# Altium schematic sheet SH8 - USB.SchDoc: Power Distribution Board Rev2 - USB
size Letter; DrawnBy: Cindy Li; Organization: Altium Limited; Address1: L3, 12a Rodborough Rd; Address2: Frenchs Forest; Address3: NSW; Address4: Australia 2086
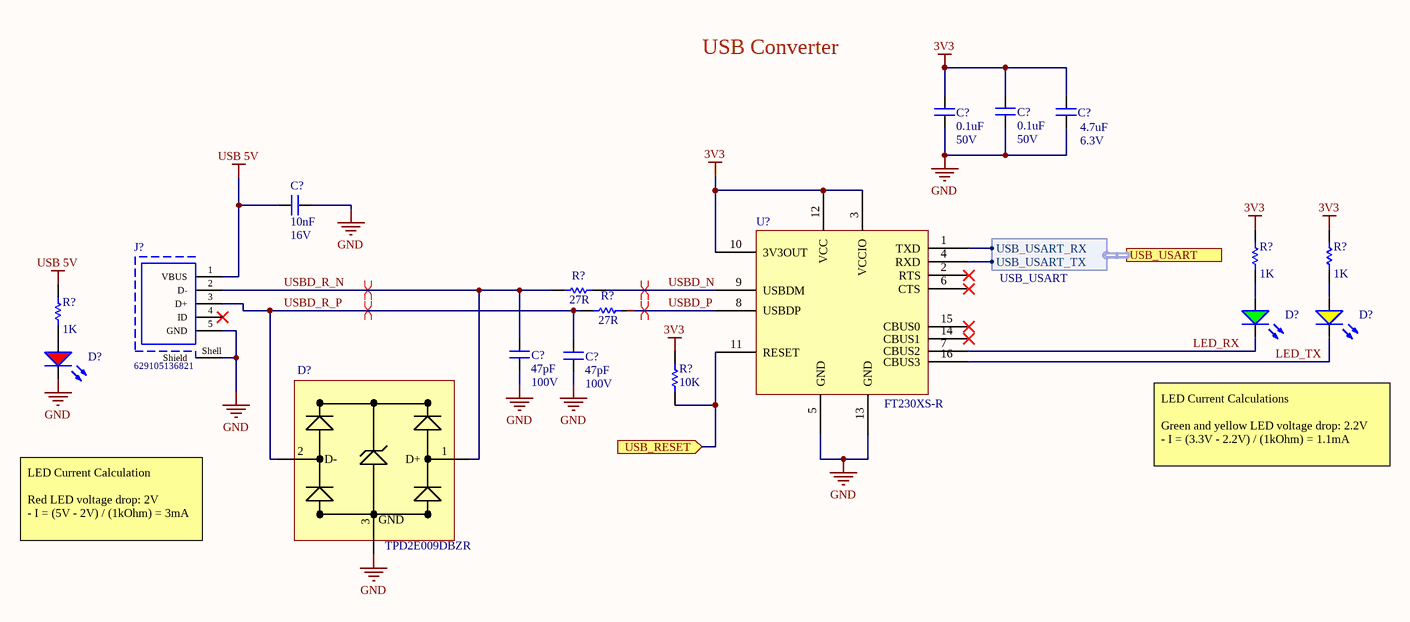
[diagram p0: SH8 - USB.SchDoc]

## Parts
(Parts that share a designator on the sheet are numbered #1, #2 ... from top to bottom, then left to right.)
C?#1  value 0.1uF  Voltage Rating: 50V  [CAPC2012X140N]  (hidden comment: CAP_0.1uF_50V_0805)
C?#2  value 0.1uF  Voltage Rating: 50V  [CAPC2012X140N]  (hidden comment: CAP_0.1uF_50V_0805)
C?#3  value 4.7uF  Voltage Rating: 6.3V  [CAPC0603(1608)55_N]  (hidden comment: CAP_4.7uF_0603)
C?#4  value 10nF  Voltage Rating: 16V  [CAPC0603(1608)55_N]  (hidden comment: CAP_10nF_0603)
C?#5  value 47pF  Voltage Rating: 100V  [CAPC1608X87N]  (hidden comment: CAP_47pF_100V_0603)
C?#6  value 47pF  Voltage Rating: 100V  [CAPC1608X87N]  (hidden comment: CAP_47pF_100V_0603)
D?#1  DIO_LED_G  [LED_0805_LINE]  (value not drawn)
D?#2  DIO_LED_Y  [LED_0805_LINE]  (value not drawn)
D?#3  DIO_LED_R  [LED_0805_LINE]  (value not drawn)
D?#4  Manufacturer Part Number: TPD2E009DBZR  [SOT23-3]  (hidden comment: TVS_DIODE_USB_5.5V)
J?  629105136821  [629105136821]
R?#1  value 1K  [RESC0603(1608)_N]  (hidden comment: RES_1K_0603)
R?#2  value 1K  [RESC0603(1608)_N]  (hidden comment: RES_1K_0603)
R?#3  Resistance: 27R  [RESC0603(1608)_N]  (hidden comment: RES_27R_0603)
R?#4  value 1K  [RESC0603(1608)_N]  (hidden comment: RES_1K_0603)
R?#5  Resistance: 27R  [RESC0603(1608)_N]  (hidden comment: RES_27R_0603)
R?#6  value 10K  [RESC0603(1608)_N]  (hidden comment: RES_10K_0603)
U?  Manufacturer Part Number 1: FT230XS-R  [SSOP16-0.635-5X4MM]  (hidden comment: IC_USB_TRANSCEIVER)

## Ports
USB_RESET (in), USB_USART (harness USB_USART)

## Harnesses
USB_USART: USB_USART_RX, USB_USART_TX

## Nets
3V3: C?#1.2 C?#2.2 C?#3.1 R?#1.2 R?#2.2 R?#6.2 U?.3(VCCIO) U?.10(3V3OUT) U?.12(VCC)
GND: C?#1.1 C?#2.1 C?#3.2 C?#4.2 C?#5.1 C?#6.2 D?#3.2(K) D?#4.3(GND) J?.5(GND) J?.Shell(Shield) U?.5(GND) U?.13(GND)
USB 5V: C?#4.1 J?.1(VBUS) R?#4.2
LED_RX: D?#1.2(K) U?.7(CBUS2)
LED_TX: D?#2.2(K) U?.16(CBUS3)
USB_RESET: R?#6.1 U?.11(RESET) ; port USB_RESET
USBD_N: R?#3.2 U?.9(USBDM)
USBD_P: R?#5.2 U?.8(USBDP)
USBD_R_N: C?#5.2 D?#4.1(D+) J?.2(D-) R?#3.1
USBD_R_P: C?#6.1 D?#4.2(D-) J?.3(D+) R?#5.1
NetD?#1_1: D?#1.1(A) R?#1.1
NetD?#2_1: D?#2.1(A) R?#2.1
NetD?#3_1: D?#3.1(A) R?#4.1
NetU?_1: U?.1(TXD) ; port USB_USART.USB_USART_RX
NetU?_4: U?.4(RXD) ; port USB_USART.USB_USART_TX

Not connected (* = marked no-connect by the designer): J? 4(ID)*; U? 2(RTS)* 6(CTS)* 14(CBUS1)* 15(CBUS0)*

## Layout directives
differential pair: (no net found under the mark), USBD_N, USBD_R_N, USBD_R_P

## Notes on the sheet
- USB Converter
- LED Current Calculations
  Green and yellow LED voltage drop: 2.2V
  - I = (3.3V - 2.2V) / (1kOhm) = 1.1mA
- LED Current Calculation
  Red LED voltage drop: 2V
  - I = (5V - 2V) / (1kOhm) = 3mA
- Title
- Size:
- Date:
- Letter
- Drawn By:
- Sheet
- of
- File:

## Library data of the parts
C?#1 C?#2 = CAP_0.1uF_50V_0805: CAP CER 0.1UF 50V X7R 0805; Manufacturer 1: Murata Electronics; Manufacturer Part Number 1: GCD21BR71H104KA01L; Capacitance: 100nF; Tolerance: 10%; Mount: Surface Mount; Case/Package: 0805; Case Code (Metric): 2012; Case Code (Imperial): 0805; Min Operating Temperature: -55°C; Max Operating Temperature: 125°C; Dielectric: X7R; Termination: SMD/SMT; Length: 2mm; Height: 1.25mm; Width: 0.049inch; Thickness: 0.049inch; Depth: 1.25mm; Ratings: AEC-Q200; ComponentLink1URL: https://datasheet.ciiva.com/29537/c03e-29537701.pdf?src-supplier=Digi-Key; ComponentLink1Description: https://datasheet.ciiva.com/29537/c03e-29537701.pdf?src-supplier=Digi-Key; Supplier 1: Digi-Key; Supplier Part Number 1: 490-11955-1-ND
C?#3 = CAP_4.7uF_0603: CAP CER 4.7UF 6.3V X5R 0603; Manufacturer Part Number 1: CC0603KRX5R5BB475; Manufacturer 1: Yageo; Dimensions: 0.063" L x 0.031" W (1.60mm x 0.80mm); Package: 0603 (1608 Metric); Temperature Coefficient: X5R; Supplier Part Number 1: 311-1521-1-ND; Supplier 1: Digi-Key; Mount: Surface Mount
C?#4 = CAP_10nF_0603: CAP CER 10000PF 16V X7R 0603; Manufacturer Part Number 1: CC0603KRX7R7BB103; Manufacturer 1: Yageo; Dimensions: 0.063" L x 0.031" W (1.60mm x 0.80mm); Package: 0603 (1608 Metric); Temperature Coefficient: X7R; Supplier Part Number 1: 311-3369-1-ND; Supplier 1: Digi-Key; Mount: Surface Mount
C?#5 C?#6 = CAP_47pF_100V_0603: CAP CER 47PF 100V C0G/NP0 0603; Manufacturer Part Number 1: C0603C470J1GACTU; Manufacturer 1: KEMET; Temperature Coefficient: C0G; Dimensions: 0.063" L x 0.031" W (1.60mm x 0.80mm); Package: 0603 (1608 Metric); Supplier Part Number 1: 399-7917-1-ND; Supplier 1: Digi-Key; Mount: Surface Mount
D?#1 = DIO_LED_G: LED GREEN DIFFUSED 0805 SMD; Manufacturer Part Number 1: LG R971-KN-1; Manufacturer 1: OSRAM; Forward Voltage Drop: 2.2V; Package: 0805 (2012 Metric); Supplier Part Number 1: 475-1410-1-ND; Supplier 1: Digi-Key; Mount: Surface Mount
D?#2 = DIO_LED_Y: LED YELLOW DIFFUSED 0805 SMD; Manufacturer Part Number 1: LY R976-PS-36; Manufacturer 1: OSRAM; Forward Voltage Drop: 2.2V; Package: 0805 (2012 Metric); Supplier Part Number 1: 475-2560-1-ND; Supplier 1: Digi-Key; Mount: Surface Mount
D?#3 = DIO_LED_R: LED RED DIFFUSED 0805 SMD; Manufacturer Part Number 1: LS R976-NR-1; Manufacturer 1: OSRAM; Forward Voltage Drop: 2V; Package: 0805 (2012 Metric); Supplier Part Number 1: 475-1278-1-ND; Supplier 1: Digi-Key; Mount: Surface Mount
D?#4 = TVS_DIODE_USB_5.5V: ESD Suppressor Diode Arrays 8KV 3-Pin SOT-23 T/R; Manufacturer: Texas Instruments; Direction: Unidirectional; Operating Supply Voltage: 6V; Capacitance: 0.9pF; Number of Channels: 2; Current Rating: 100nA; Peak Pulse Current: 1A; Element Configuration: Dual; Reverse Standoff Voltage: 5.5V; Min Breakdown Voltage: 9V; Clamping Voltage: 8V; Peak Pulse Power: 45W; Power Line Protection: Yes; Breakdown Voltage: 7V; Interface: LVDS,PCIe,SATA; Supplier 1: Digi-Key; RoHS: Yes; Category: Interface ICs; Stock 1: 98615; Pricing 1: 1=0.56000, 10=0.48000, 25=0.44800, 100=0.33280, 250=0.31616, 500=0.25984, 1000=0.21120 (USD); Case/Package: SOT-23; Number of Pins: 3; Min Operating Temperature: -40°C; Max Operating Temperature: 85°C; Packaging: Tape and Reel; Package Quantity: 1; Number of Bidirectional Channels: 2; Termination: SMD/SMT; Max Power Dissipation: 45W; Working Voltage: 5.5V; Length: 2.92mm; Height: 1mm; Width: 1.3mm; Depth: 1.3mm; Radiation Hardening: No; REACH SVHC: No SVHC; Lead Free: Lead Free; ComponentLink1URL: https://datasheet.ciiva.com/353/tpd2e009-353266.pdf?src-supplier=Digi-Key; ComponentLink1Description: https://datasheet.ciiva.com/353/tpd2e009-353266.pdf?src-supplier=Digi-Key; ComponentLink2URL: https://datasheet.ciiva.com/15134/getdatasheetpartid-243395-15134537.pdf?src-supplier=Verical; ComponentLink2Description: https://datasheet.ciiva.com/15134/getdatasheetpartid-243395-15134537.pdf?src-supplier=Verical; ComponentLink3URL: https://datasheet.ciiva.com/4479/slvs953a-121037-4479453.pdf?src-supplier=Mouser; ComponentLink3Description: https://datasheet.ciiva.com/4479/slvs953a-121037-4479453.pdf?src-supplier=Mouser; ComponentLink4URL: https://datasheet.ciiva.com/353/tpd2e009-353268.pdf?src-supplier=Digi-Key; ComponentLink4Description: https://datasheet.ciiva.com/353/tpd2e009-353268.pdf?src-supplier=Digi-Key; ComponentLink5URL: https://datasheet.ciiva.com/353/tpd2e009-353267.pdf?src-supplier=Digi-Key; ComponentLink5Description: https://datasheet.ciiva.com/353/tpd2e009-353267.pdf?src-supplier=Digi-Key; ComponentLink6URL: https://datasheet.ciiva.com/46384/1707898-46384524.pdf?src-supplier=Element14; ComponentLink6Description: https://datasheet.ciiva.com/46384/1707898-46384524.pdf?src-supplier=Element14; Supplier Part Number 1: 296-24657-1-ND
J? = WE 629105136821: Micro USB 2.0 Type B Receptacle WR-COM, Horizontal, SMT, with Pads and Pegs; Manufacturer: Wurth Elektronik; Contact Resistance: 30mOhm; Rated Current: 1A; Working Voltage: 30VAC; Datasheet URL: https://katalog.we-online.de/em/datasheet/629105136821.pdf; Mounting Technology: SMT; Publisher: WurthElektronik; Package Reference: 629105136821; Orientation: Horizontal; Packaging: TapeandReel; Part Number: 629105136821; Manufacturer URL: http://www.we-online.de; Connector Type: MicroUSB2.0TypeB; Gender: Receptacle; Operating Temperature: -40to105degC
R?#1 R?#2 R?#4 = RES_1K_0603: RES SMD 1K OHM 5% 1/10W 0603; Manufacturer 1: Yageo; Manufacturer Part Number 1: RC0603JR-071KL; Dimensions: 0.063" L x 0.031" W (1.60mm x 0.80mm); Tolerance: 5%; Package: 0603 (1608 Metric); Supplier Part Number 1: 311-1.0KGRCT-ND; Supplier 1: Digi-Key; Mount: Surface Mount
R?#3 R?#5 = RES_27R_0603: RES SMD 27 OHM 5% 1/10W 0603; Manufacturer: Yageo; Manufacturer Part Number: RC0603JR-0727RL; Voltage Rating (DC): 50V; Power Rating: 100mW; Temperature Coefficient: 100ppm/°C; Supplier 1: Digi-Key; RoHS: Yes; Category: Chip SMD Resistors; Stock 1: 2055343; Pricing 1: 1=0.10000, 10=0.01900, 100=0.00770, 1000=0.00347, 2500=0.00301 (USD); Case/Package: 0603; Number of Pins: 2; Case Code (Imperial): 0603; Case Code (Metric): 1608; Min Operating Temperature: -55°C; Max Operating Temperature: 155°C; Tolerance: 5%; Voltage Rating: 50V; Packaging: Tape and Reel; Termination: SMD/SMT; Composition: Thick Film; Military Standard: Not; Length: 1.6mm; Width: 0.8mm; Depth: 0.8mm; Lead Free: Lead Free; REACH SVHC: No SVHC; ComponentLink1URL: https://datasheet.ciiva.com/7746/443971-7746479.pdf?src-supplier=Element14; ComponentLink1Description: https://datasheet.ciiva.com/7746/443971-7746479.pdf?src-supplier=Element14; Supplier Part Number 1: 311-27GRCT-ND
R?#6 = RES_10K_0603: RES SMD 10K OHM 5% 1/10W 0603; Manufacturer 1: Yageo; Manufacturer Part Number 1: RC0603JR-0710KL; Package: 0603 (1608 Metric); Dimensions: 0.063" L x 0.031" W (1.60mm x 0.80mm); Tolerance: 5%; Supplier Part Number 1: 311-10KGRCT-ND; Supplier 1: Digi-Key; Mount: Surface Mount
U? = IC_USB_TRANSCEIVER: Manufacturer 1: FTDI, Future Technology Devices International Ltd; Supplier 1: Digi-Key; Supplier Part Number 1: 768-1135-1-ND